# Altium project USBSticker01-02.PrjPCB
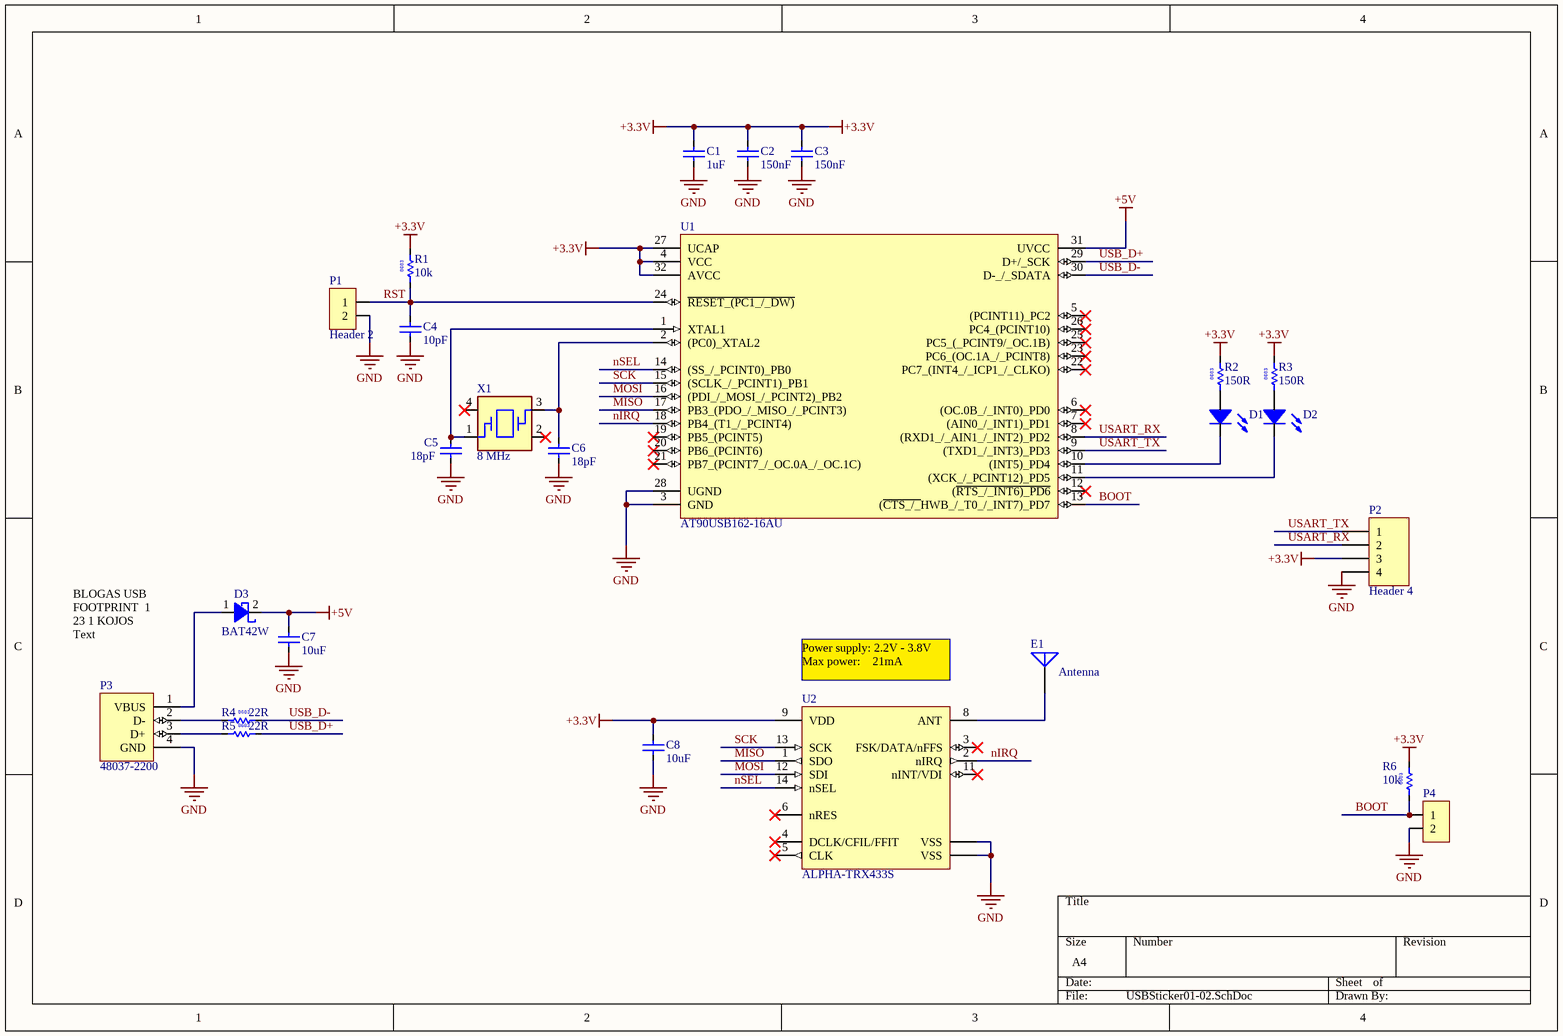
[diagram p0: USBSticker01-02.SchDoc]
1 sheet, 25 parts. Net scope: global (net labels, ports and power ports of the same name join across sheets).
Board file: USBSticker01-02.PcbDoc

## Sheet USBSticker01-02.SchDoc
size A4

### Parts
C1  1uF  [CAPC1608N]
C2  150nF  [CAPC1608N]
C3  150nF  [CAPC1608N]
C4  10pF  [CAPC1608N]
C5  18pF  [CAPC2012N]
C6  18pF  [CAPC2012N]
C7  10uF  [CAPC3216N]
C8  10uF  [CAPC3216N]
D1  KPT-2012QBC-D  [D0805]  (value not drawn)
D2  KPT-2012QBC-D  [D0805]  (value not drawn)
D3  BAT42W  [SOD123]
E1  Antenna
P1  Header 2  [HDR1X2]
P2  Header 4  [HDR1X4]
P3  48037-2200  [MOLEX 48037-2200]
P4  Header 2  [HDR1X2]  (value not drawn)
R1  10k  [RESC1608N]
R2  150R  [RESC1608N]
R3  150R  [RESC1608N]
R4  22R  [RESC1608X50N]
R5  22R  [RESC1608X50N]
R6  10k  [RESC1608N]
U1  AT90USB162-16AU  [QFP80P900X900X120-32N]
U2  ALPHA-TRX433S  [ALPHA-TRX]
X1  8 MHz  [2SMX-3SMXB]

### Nets
+3.3V: C1.2 C2.2 C3.2 C8.2 P2.3 R1.2 R2.2 R3.2 R6.2 U1.4(VCC) U1.27(UCAP) U1.32(AVCC) U2.9(VDD)
+5V: C7.2 D3.2(CATHODE) U1.31(UVCC)
GND: C1.1 C2.1 C3.1 C4.1 C5.1 C6.1 C7.1 C8.1 P1.2 P2.4 P3.4(GND) P4.2 U1.3(GND) U1.28(UGND) U2.7(VSS) U2.10(VSS)
BOOT: P4.1 R6.1 U1.13((~{CTS_/_}HWB_/_T0_/_INT7)_PD7)
MISO: U1.17(PB3_(PDO_/_MISO_/_PCINT3)) U2.1(SDO)
MOSI: U1.16((PDI_/_MOSI_/_PCINT2)_PB2) U2.12(SDI)
nIRQ: U1.18(PB4_(T1_/_PCINT4)) U2.2(nIRQ)
nSEL: U1.14((SS_/_PCINT0)_PB0) U2.14(nSEL)
RST: C4.2 P1.1 R1.1 U1.24(~{RESET_(PC1_/_DW)})
SCK: U1.15((SCLK_/_PCINT1)_PB1) U2.13(SCK)
USART_RX: P2.2 U1.8((RXD1_/_AIN1_/_INT2)_PD2)
USART_TX: P2.1 U1.9((TXD1_/_INT3)_PD3)
USB_D+: R5.2 U1.29(D+/_SCK)
USB_D-: R4.2 U1.30(D-_/_SDATA)
NetC5_2: C5.2 U1.1(XTAL1) X1.1
NetC6_2: C6.2 U1.2((PC0)_XTAL2) X1.3
NetD1_1: D1.1 R2.1
NetD1_2: D1.2 U1.10((INT5)_PD4)
NetD2_1: D2.1 R3.1
NetD2_2: D2.2 U1.11((XCK_/_PCINT12)_PD5)
NetD3_1: D3.1(ANODE) P3.1(VBUS)
NetE1_1: E1.1(A) U2.8(ANT)
NetP3_2: P3.2(D-) R4.1
NetP3_3: P3.3(D+) R5.1

Not connected (* = marked no-connect by the designer): U1 5((PCINT11)_PC2)* 6((OC.0B_/_INT0)_PD0)* 7((AIN0_/_INT1)_PD1)* 12((~{RTS_/_INT6)_PD6})* 19(PB5_(PCINT5))* 20(PB6_(PCINT6))* 21(PB7_(PCINT7_/_OC.0A_/_OC.1C))* 22(PC7_(INT4_/_ICP1_/_CLKO))* 23(PC6_(OC.1A_/_PCINT8))* 25(PC5_(_PCINT9/_OC.1B))* 26(PC4_(PCINT10))*; U2 3(FSK/DATA/nFFS)* 4(DCLK/CFIL/FFIT)* 5(CLK)* 6(nRES)* 11(nINT/VDI)*; X1 2* 4*

### Notes on the sheet
- BLOGAS USB FOOTPRINT  1 23 1 KOJOS
  Text
- (near U2) Power supply: 2.2V - 3.8V
  Max power:    21mA
- (in symbol R0000008) 0603
- (in symbol R0000136) 0603
- (in symbol R2406052) 0603

### Library data of the parts
C1 = C0000022: MLCC, 0603, X6S, 25V, 1uF; Manufacturer: MURATA; Manufacturer Part Number: GRM188C81E105KA12D; Voltage: 25; Tolerance: ±10%; Project: AUT-RX03-00; Note: 0,05 €; Part Number: C0000022; Part Type: MLCC; Material: X6S; Package: 0603 (1608 metric); SMD: Yes; Supplier 1: Farnell; Supplier Part Number 1: 1907506; Supplier 2: Mouser; Supplier Part Number 2: 81-GRM188R61C105KA3J; ComponentLink1Description: MFG link; ComponentLink1URL: http://search.murata.co.jp/Ceramy/CatalogAction.do?sHinnm=?&nbsp&sNHinnm=GRM188R61C105KA93J&sNhin_key=GRM188R61C105KA93J&sLang=en&sParam=GRM18; Data: 2011.03.03
C2 C3 = C0000001: MLCC, 150nF 16V -20+80% Y5V; Manufacturer: YAGEO; Manufacturer Part Number: CTC0603ZRY5V7BB154; Voltage: 16; Project: PSP500; Part Number: C0000001; Part Type: MLCC; Tolerance: -20+80%; Material: Y5V; Package: 0603 (1608 metric); SMD: Yes; Supplier 1: Farnell; Supplier Part Number 1: 3352006; Supplier 2: Mouser; Supplier Part Number 2: 80-C0603C154K4R; ComponentLink1Description: MFG link; ComponentLink1URL: http://www.yageo.com/documents/recent/UPY-GPHC_Y5V_6.3V-to-50V_5.pdf; ComponentLink2URL: \\193.219.36.50\nescafe\Altium Database\KTU340DB\PDF\Capacitor\Multilayer Ceramic\UPY-GPHC_Y5V_6.3V-to-50V_5.pdf; Data: 2011.01.31
C4 = C0000042: MLCC, 0603, NP0, 50V, 10PF; Manufacturer: MULTICOMP; Manufacturer Part Number: MCCA000192; Voltage: 100; Material: C0G / NP0; Project: Zhilinskas_I/II/III; Part Number: C0000042; Part Type: MLCC; Package: 0603 (1608 metric); SMD: Yes; Supplier 1: Farnell; Supplier Part Number 1: 1759053; Price: 0,02; MOQ: 100; Supplier 2: Mouser; Supplier Part Number 2: 77-VJ0603A100JXACBC; ComponentLink1Description: MFG link; ComponentLink1URL: http://www.farnell.com/datasheets/654515.pdf; Data: 2011.06.12
C5 C6 = C0000048: MLCC, 0805, NPO, 50V, 18pF; Manufacturer: MULTICOMP; Manufacturer Part Number: MCCA000321; Voltage: 50; Tolerance: ±5%; Material: C0G / NP0; Project: Mechanikai_II; Part Number: C0000048; Part Type: MLCC; Package: 0805 (2012 metric); SMD: Yes; Supplier 1: Farnell; Supplier Part Number 1: 1759194RL; Price: 0,03; MOQ: 100; ComponentLink1Description: MFG link; Data: 2011.06.17
C7 C8 = C0000011: MLCC, 10uF 25V -20%, +80% Y5V 1206; Manufacturer: MULTICOMP; Manufacturer Part Number: MC1206F106Z250CT; Voltage: 25; Project: PSP500; Part Number: C0000011; Part Type: MLCC; Tolerance: -20%, +80%; Material: Y5V; Package: 1206 (3216 metric); SMD: Yes; Supplier 1: Farnell; Supplier Part Number 1: 1759453; Price: 0,299; ComponentLink1Description: MFG link; ComponentLink1URL: http://www.farnell.com/datasheets/461910.pdf; Data: 2011.02.01
D1 D2 = D0000005: LED, SMD, 0805, BLUE, 100mCd; Manufacturer: KINGBRIGHT; Vforvard: 3.3; Current: 20mA; Part Number: D0000005; Part Type: Diode\LED; Rating: 100 mCd; SMD: Yes; Manufacturer Part Number: KPT-2012QBC-D; ComponentLink1Description: MFG link; ComponentLink2Description: DataSheet; Data: 2011.02.27; Supplier 1: Farnell; Supplier Part Number 1: 2217980
D3 = D0000003: Diode Schottkey, 30V, Vf=1V, If=1A, rrt=5ns, SOD123, -55°C to +125°C; Manufacturer: VISHAY SEMICONDUCTOR; Manufacturer Part Number: BAT42W-V-GS18; Vforvard: 1V; Current: 0.2A; Capacitance: 7pF; Rating: 200mW; Project: PSP500; Part Number: D0000003; Part Type: Diode\Schottky; Reverse Voltage: 30V; SMD: Yes; Price: 0,84; ComponentLink1Description: MFG link; ComponentLink1URL: http://www.vishay.com/docs/85661/bat42w-v.pdf; ComponentLink2Description: BAT42W; ComponentLink2URL: \\193.219.36.50\nescafe\Altium Database\KTU340DB\PDF\Diodes\Schottkey\bat42w-v.pdf; Data: 2011.01.28; Supplier 1: Farnell; Supplier Part Number 1: 1612326; Supplier 2: Mouser; Supplier Part Number 2: 78-BAT42W-VGS18
E1 = Antenna: Generic Antenna; Published: 24-Mar-1999; LatestRevisionDate: 17-Jul-2002; LatestRevisionNote: Re-released for DXP Platform.; PackageReference: PIN1; Publisher: Altium Limited
P1 P4 = Header 2: Header, 2-Pin; LatestRevisionDate: 17-Jul-2002; LatestRevisionNote: Re-released for DXP Platform.; Publisher: Altium Limited
P2 = Header 4: Header, 4-Pin; LatestRevisionDate: 17-Jul-2002; LatestRevisionNote: Re-released for DXP Platform.; Publisher: Altium Limited
P3 = 48037-2200: SOCKET, USB, PCB, R/A, TYPE A; Manufacturer: MOLEX; Manufacturer Part Number: 48037-2200; Supplier Part Number 1: 2313729; Supplier 1: Farnell; Data Sheet: http://www.farnell.com/cad/1701284.pdf
R1 R6 = R0000008: Res, 10K 0.063W 75V 1%  0603; Manufacturer: MULTICOMP; Manufacturer Part Number: MCMR06X1002FTL; Project: AUT-RX03-00; Note: 0,033 €; R2408042: R0000008; Part type: Thick Film; Tolerance: ±1%; Power: 0.063W; Package: 0603 (1608 metric); SMD: Yes; Supplier 1: Farnell; Supplier Part Number 1: 2073349; Supplier 2: Mouser; Supplier Part Number 2: 594-MCT06030C1002FP5; ComponentLink1Description: Datasheet MFG; ComponentLink1URL: http://www.vishay.com/doc?28705; Data: 2011.02.28
R2 R3 = R2406052: 150R 5% 0603 1/10W; R2408042: R2406052; Part type: Carbon Film; Tolerance: ±5%; Power: 1/10W; Package: 0603 (1608 metric); SMD: Yes; Data: 2011.01.31
R4 R5 = R0000136: Res, 22R, 0603 (1608 metric), ±1%, 100mW, 75V; R2408042: R0000136
U1 = AT90USB162-16AU: Manufacturer: Atmel; Supplier 1: Farnell
U2 = ALPHA-TRX433S: RF SOLUTIONS  ALPHA-TRX433S  RF MODULE, TRANSCEIVER, FSK, 433MHZ; Manufacturer Part Number: ALPHA-TRX433S; Manufacturer: RF SOLUTIONS; Data Sheet: http://www.farnell.com/datasheets/1718776.pdf; Supplier 1: Farnell; Supplier Part Number 1: 1718689
X1 = M0000014: CRYSTAL, 8M, 18PF CL, 6X3.6MM SMT; Manufacturer: ABRACON; Manufacturer Part Number: ABMM2-8.000MHZ-E2-T; Rating: 8MHz; Tolerance: ± 20ppm; Note: 1; Part Number: M0000014; Part Type: Crystals\XTAL; SMD: Yes; Supplier 1: Farnell; Supplier Part Number 1: 1611803; Price: 2,57; MOQ: 1; Supplier 2: Mouser; Supplier Part Number 2: 815-ABMM2-8-E2T; ComponentLink1Description: MFG link; ComponentLink2Description: Datasheet PDF; ComponentLink2URL: http://www.abracon.com/Resonators/ABMM2.pdf; Qty: 7; Data: 2011.02.17